# EAGLE design ASD2003 (EAGLE 6.3)
DATABASE: ./../../../../../Components/TinyCircuits_Part_Database.txt
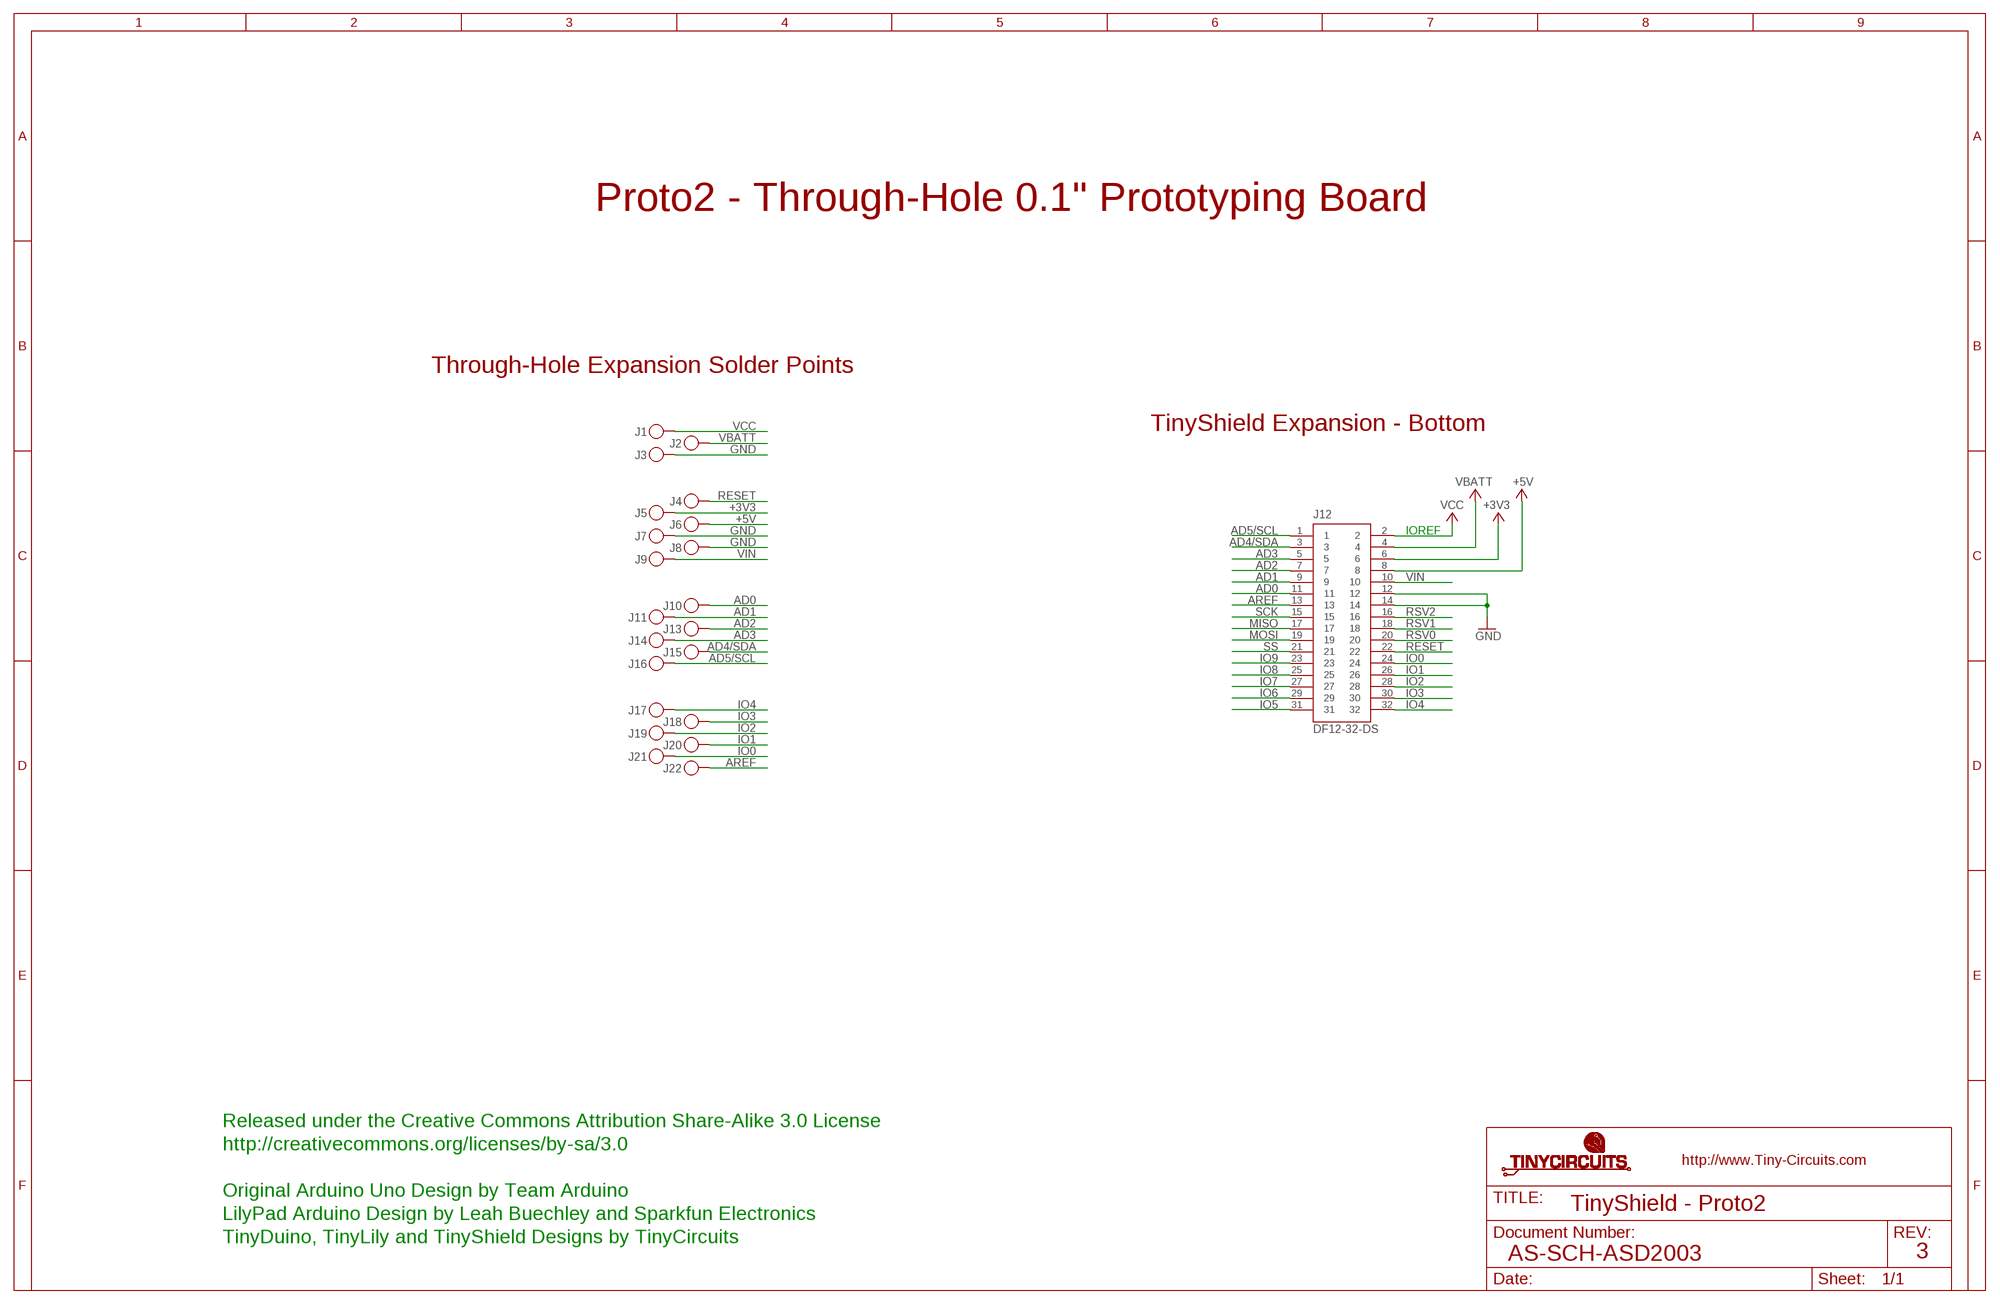
[diagram p0: schematic, sheet 1]

## Parts
J1  PIN_1X.1"1  [1X.1"_2]
J2  PIN_1X.1"1  [1X.1"_2]
J3  PIN_1X.1"1  [1X.1"_2]
J4  PIN_1X.1"1  [1X.1"_2]
J5  PIN_1X.1"1  [1X.1"_2]
J6  PIN_1X.1"1  [1X.1"_2]
J7  PIN_1X.1"1  [1X.1"_2]
J8  PIN_1X.1"1  [1X.1"_2]
J9  PIN_1X.1"1  [1X.1"_2]
J10  PIN_1X.1"1  [1X.1"_2]
J11  PIN_1X.1"1  [1X.1"_2]
J12  DF12-32-DS  AS-ITM-00012  [DF12-32-DS]
J13  PIN_1X.1"1  [1X.1"_2]
J14  PIN_1X.1"1  [1X.1"_2]
J15  PIN_1X.1"1  [1X.1"_2]
J16  PIN_1X.1"1  [1X.1"_2]
J17  PIN_1X.1"1  [1X.1"_2]
J18  PIN_1X.1"1  [1X.1"_2]
J19  PIN_1X.1"1  [1X.1"_2]
J20  PIN_1X.1"1  [1X.1"_2]
J21  PIN_1X.1"1  [1X.1"_2]
J22  PIN_1X.1"1  [1X.1"_2]

## Nets
+3V3: J5.1 J12.6
+5V: J6.1 J12.8
AD0: J10.1 J12.11
AD1: J11.1 J12.9
AD2: J12.7 J13.1
AD3: J12.5 J14.1
AD4/SDA: J12.3 J15.1
AD5/SCL: J12.1 J16.1
AREF: J12.13 J22.1
GND: J3.1 J7.1 J8.1 J12.12 J12.14
IO0: J12.24 J21.1
IO1: J12.26 J20.1
IO2: J12.28 J19.1
IO3: J12.30 J18.1
IO4: J12.32 J17.1
IO5: J12.31
IO6: J12.29
IO7: J12.27
IO8: J12.25
IO9: J12.23
MISO: J12.17
MOSI: J12.19
RESET: J4.1 J12.22
RSV0: J12.20
RSV1: J12.18
RSV2: J12.16
SCK: J12.15
SS: J12.21
VBATT: J2.1 J12.4
VCC: J1.1 J12.2
VIN: J9.1 J12.10

## Notes on the sheet
- Proto2 - Through-Hole 0.1" Prototyping Board
- Through-Hole Expansion Solder Points
- TinyShield Expansion - Bottom
- IOREF
- Released under the Creative Commons Attribution Share-Alike 3.0 License
- http://creativecommons.org/licenses/by-sa/3.0
- Original Arduino Uno Design by Team Arduino
- TinyShield - Proto2
- LilyPad Arduino Design by Leah Buechley and Sparkfun Electronics
- TinyDuino, TinyLily and TinyShield Designs by TinyCircuits
- AS-SCH-ASD2003 | 3

## Library data of the parts
J1-J11 J13-J22 = tinycircuits:PIN_1X.1": 1 Pin 0.100" Header; BOM: EXCLUDE; DNP: T; PARTNO: COPPER
J12 = tinycircuits:AS-ITM-00012: CONN RECEPT 32POS 3MM SMD 0.5MM; PARTNO: AS-ITM-00012

## Board
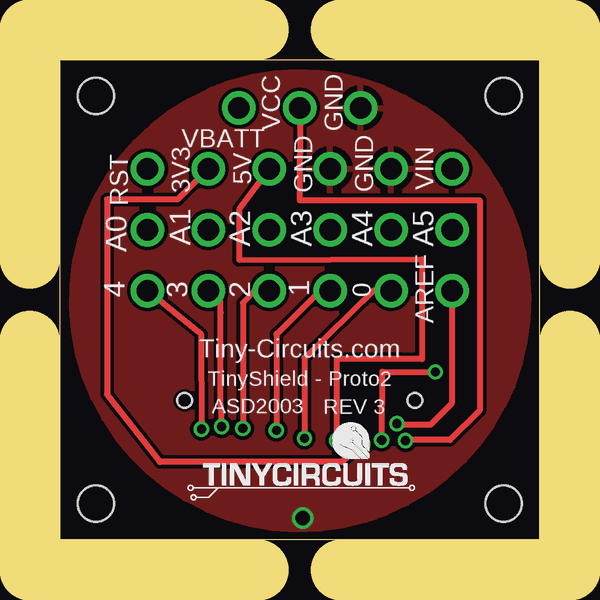
[diagram p1: board, top side]
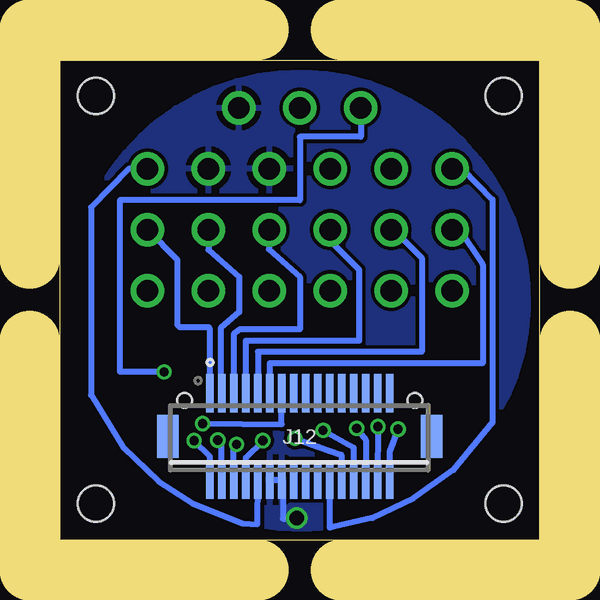
[diagram p2: board, bottom side, seen from below]

Size 20 x 20 mm. Coordinates in mm from the lower left corner, seen from the top.
Outline: 0,0 0,20 20,20 20,0 0,0
Copper layers (1*16): Top 0.035mm / dielectric 1.5mm / Bottom 0.035mm
Design rules "default *": minimum track width 8mil, minimum drill 15mil, track to track 6mil, track to pad 6mil, pad to pad 6mil, via to via 6mil, smd to smd 6mil, copper to edge 6mil, drill to drill 8mil, minimum pad ring 10mil, minimum via ring 5mil, stop-mask expansion 4mil, vias tented up to drill 25mil, thermal gap 10mil
Holes 1.5 mm at 1.5,18.5 18.5,18.5 18.5,1.5 1.5,1.5
Milling: 8 lines

### Footprints (pad centres in the part's own frame; a part is rotated, then mirrored left to right if it is on the bottom)
1X.1"_2 = drill 0.889 pad 1.397: 1 0,0
DF12-32-DS = smd 0.3 x 1.6: 1 -3.75,1.8; 2 -3.75,-1.8; 3 -3.25,1.8; 4 -3.25,-1.8; 5 -2.75,1.8; 6 -2.75,-1.8; 7 -2.25,1.8; 8 -2.25,-1.8; 9 -1.75,1.8; 10 -1.75,-1.8; 11 -1.25,1.8; 12 -1.25,-1.8; 13 -0.75,1.8; 14 -0.75,-1.8; 15 -0.25,1.8; 16 -0.25,-1.8; 17 0.25,1.8; 18 0.25,-1.8; 19 0.75,1.8; 20 0.75,-1.8; 21 1.25,1.8; 22 1.25,-1.8; 23 1.75,1.8; 24 1.75,-1.8; 25 2.25,1.8; 26 2.25,-1.8; 27 2.75,1.8; 28 2.75,-1.8; 29 3.25,1.8; 30 3.25,-1.8; 31 3.75,1.8; 32 3.75,-1.8 | smd 0.9 x 1.8: F1 -5.5,0; F2 5.5,0 | hole 0.6: -4.8,1.5; 4.8,1.5

### Placement (x,y rotation side)
J1  10,18 0 top
J2  7.46,18 0 top
J3  12.54,18 0 top
J4  3.65,15.46 0 top
J5  6.19,15.46 0 top
J6  8.73,15.46 0 top
J7  11.27,15.46 0 top
J8  13.81,15.46 0 top
J9  16.35,15.46 0 top
J10  3.65,12.92 0 top
J11  6.19,12.92 0 top
J12  10,4.3 0 bottom
J13  8.73,12.92 0 top
J14  11.27,12.92 0 top
J15  13.81,12.92 0 top
J16  16.35,12.92 0 top
J17  3.65,10.38 0 top
J18  6.19,10.38 0 top
J19  8.73,10.38 0 top
J20  11.27,10.38 0 top
J21  13.81,10.38 0 top
J22  16.35,10.38 0 top
U$1  [DOCFIELD-TINYCIRCUITS-PCB]  33.91,-10 0 top  (outside the outline)

### Tracks (layer width: path | path; a pad name or v marks a point on that pad's centre or on a via)
+3V3  (via drill 0.38)
  Top 0.254: J5.1 4.91,14.18 1.96,14.18 1.96,6.05 4.17,3.23 11.74,3.23 v12.63,3.97
  Bottom 0.254: J12.6 12.76,3.79 v12.63,3.97
+5V  (via drill 0.38)
  Top 0.254: J6.1 7.48,13.77 7.48,11.67 15.09,11.69 15.09,7.53 11.54,7.53 v11.54,4.12
  Bottom 0.254: v11.54,4.12 12.25,3.41 J12.8
AD0
  Bottom 0.254: J10.1 3.34,12.92 2.37,11.46 2.37,7.35 11.26,7.35 J12.11
AD1
  Bottom 0.254: J11.1 6.09,12.92 4.91,11.74 4.91,7.83 11.74,7.83 J12.9
AD2
  Bottom 0.254: J13.1 8.73,12.46 7.53,11.26 7.53,8.29 12.25,8.29 J12.7
AD3
  Bottom 0.254: J12.5 12.76,6.14 12.76,8.57 12.5,8.77 9.99,8.77 9.99,10.95 11.29,12.1 J14.1
AD4/SDA
  Bottom 0.254: J15.1 13.81,12.08 12.53,10.95 12.53,9.48 13.29,8.82 13.29,6.14 J12.3
AD5/SCL
  Bottom 0.254: J12.1 13.75,8.8 13.8,8.85 14.99,8.85 15.09,8.95 15.09,11.66 J16.1
AREF  (via drill 0.38)
  Top 0.254: J22.1 16.34,5.67 15.45,4.78 14.11,4.78 v14.05,4.83
  Bottom 0.254: v14.05,4.83 10.75,4.81 J12.13
GND  (via drill 0.6)
  Bottom 0.254: J12.12 J12.14 10.7,2.5 10.7,0.87 10.12,0.87 v10.12,0.9
  pour Top: 18.49,5.61 arc180 1.54,14.32 arc180
  pour Bottom: 18.49,5.61 arc180 1.54,14.32 arc180
IO0  (via drill 0.38)
  Top 0.254: J21.1 13.07,10.38 10.19,7.58 v10.19,4.22
  Bottom 0.254: v10.19,4.22 9.23,3.87 8.26,3.54 8.26,2.51 J12.24
IO1  (via drill 0.38)
  Top 0.254: J20.1 10.86,10.38 9.18,8.69 9.02,8.57 v9.02,4.55
  Bottom 0.254: v9.02,4.55 7.75,3.84 J12.26
IO2  (via drill 0.38)
  Top 0.254: J19.1 8.14,10.38 7.63,9.86 v7.63,4.63
  Bottom 0.254: J12.28 7.25,2.48 7.25,4.15 v7.63,4.63
IO3  (via drill 0.38)
  Top 0.254: v6.74,4.71 6.7,5.61 6.7,9.46 6.69,9.46 6.69,9.91 J18.1
  Bottom 0.254: v6.74,4.71 6.74,4.73 6.76,2.54 J12.30
IO4  (via drill 0.38)
  Top 0.254: J17.1 5.88,8.58 v5.9,4.61
  Bottom 0.254: v5.9,4.61 6.25,3.66 J12.32
RESET
  Bottom 0.254: J4.1 3.22,15.46 1.96,14.18 1.96,4.88 3.59,2.9 5.27,1.71 6.97,0.9 8.59,0.54 8.75,0.49 J12.22
VBATT  (via drill 0.38)
  Top 0.254: v13.42,4.15 13.44,6.99 v15.65,6.99 15.81,6.99
  Bottom 0.254: J2.1 7.45,16.8 9.99,16.8 9.99,14.16 17.51,14.16 17.51,6.99 v15.65,6.99 | J12.4 13.27,2.5 13.27,3.89 13.37,4.1 v13.42,4.15
VCC  (via drill 0.38)
  Top 0.254: J1.1 9.99,14.16 17.51,14.16 17.51,5.39 16.26,4.15 14.43,4.15 v14.41,4.12
  Bottom 0.254: J12.2 13.75,3.46 v14.41,4.12
VIN
  Bottom 0.254: J9.1 17.12,15.46 18.7,13.85 18.7,6.03 17.36,3.84 15.88,2.42 14.43,1.48 12.38,0.67 11.77,0.64 J12.10

### Text on the board
tPlace: VBATT | VCC | GND | 5V | VIN | RST | 3V3 | GND | GND | A0 | A1 | A2 | A3 | A4 | A5 | 4 | 3 | 2 | 1 | 0 | AREF | Tiny-Circuits.com | TinyShield - Proto2 | ASD2003 | REV 3
Document: FABRICATION DRAWING | NOTES: | 1. PRINTED CIRCUIT BOARD MADE FROM NEMA GRADE FR-4 EPOXY LAMINATE | WITH 1 OUNCE COPPER PLATING AND .024 THICKNESS. | 2. ALL DIMENSIONS ARE GIVEN IN INCHES. | 3. CIRCUIT PATHS ARE FOR REFERENCE ONLY. | 4. HOLE SIZES SHOWN ARE FINISHED DIAMETERS AFTER PLATING. | 5. BOARD PLATED USING REFLOW OR SIMILAR METHOD. | 6. BOARD TO HAVE BLUE SOLDER MASK ON PLATED SURFACES USING WET FILM | 7. SILKSCREEN BOARD USING WHITE INK. | SR100 OR SR1010 EPOXY. EQUIVALENT WET OR DRY FILM MAY BE USED. | 8. THE FOLLOWING INFORMATION APPLIES TO THIS BOARD: | * 2 COPPER LAYERS | * .024 BOARD THICKNESS | * REQUIRES TOP SIDE SILKSCREEN | Released under the Creative Commons Attribution Share-Alike 3.0 License | http://creativecommons.org/licenses/by-sa/3.0 | Original Arduino Uno Design by Team Arduino | LilyPad Arduino Design by Leah Buechley and Sparkfun Electronics | TinyDuino, TinyLily and TinyShield Designs by TinyCircuits | TinyShield - Proto2 | AS-PCB-ASD2003 | 3 | 1/1